# EAGLE design Caurin_CDH v.1.0 (EAGLE 9.2.0)
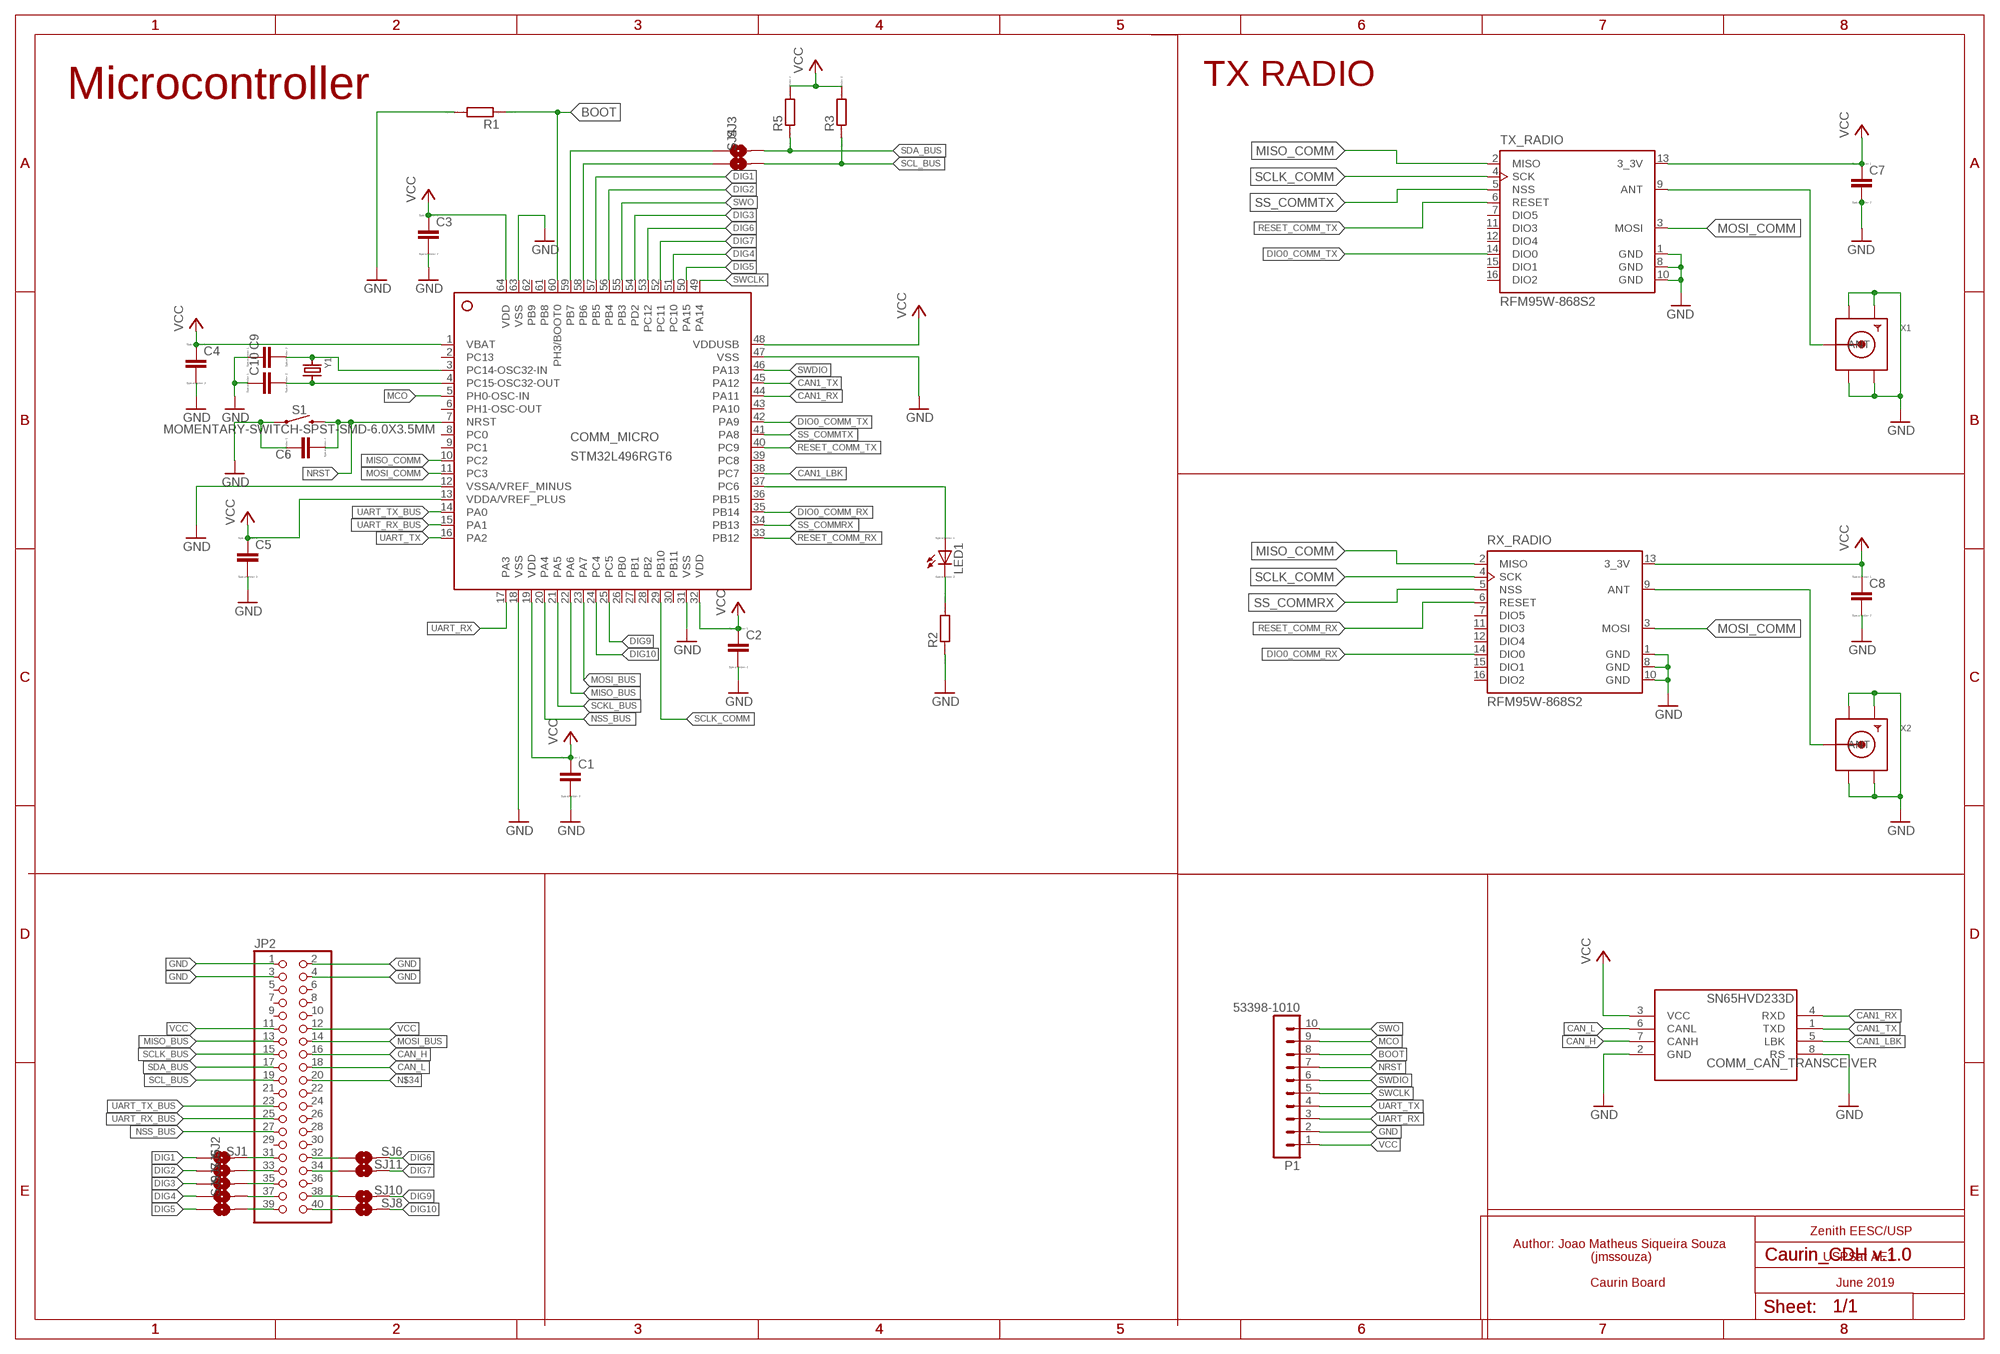
[diagram p0: schematic, sheet 1]

## Parts
C1  CC1206  [C1206]
C2  CC1206  [C1206]
C3  CC1206  [C1206]
C4  CC1206  [C1206]
C5  CC1206  [C1206]
C6  CC1206  [C1206]
C7  CC1206  [C1206]
C8  CC1206  [C1206]
C9  CC1206  [C1206]
C10  CC1206  [C1206]
COMM_CAN_TRANSCEIVER  SN65HVD233D  [SOIC8]
COMM_MICRO  STM32L496RGT6  [LQFP64_10X10]
JP2  PINHD-2X20  [2X20]
LED1  LED_E  [LED_1206]
P1  53398-1010  [53398-1010]
R1  RR1206  [R1206]
R2  RR1206  [R1206]
R3  RR1206  [R1206]
R5  RR1206  [R1206]
RX_RADIO  RFM95W-868S2  [XCVR_RFM95W-868S2]
S1  MOMENTARY-SWITCH-SPST-SMD-6.0X3.5MM  [TACTILE_SWITCH_SMD_6.0X3.5MM]
SJ1  SMD-JUMPER-2  [SMD-JUMPER-2]
SJ2  SMD-JUMPER-2  [SMD-JUMPER-2]
SJ3  SMD-JUMPER-2  [SMD-JUMPER-2]
SJ4  SMD-JUMPER-2  [SMD-JUMPER-2]
SJ5  SMD-JUMPER-2  [SMD-JUMPER-2]
SJ6  SMD-JUMPER-2  [SMD-JUMPER-2]
SJ7  SMD-JUMPER-2  [SMD-JUMPER-2]
SJ8  SMD-JUMPER-2  [SMD-JUMPER-2]
SJ9  SMD-JUMPER-2  [SMD-JUMPER-2]
SJ10  SMD-JUMPER-2  [SMD-JUMPER-2]
SJ11  SMD-JUMPER-2  [SMD-JUMPER-2]
TX_RADIO  RFM95W-868S2  [XCVR_RFM95W-868S2]
X1  SMACONNECTOR  [SMA90_DIP]
X2  SMACONNECTOR  [SMA90_DIP]
Y1  CRYSTAL8X3.8SMT  [CRYSTAL_8X3.8]

## Nets
BOOT: COMM_MICRO.60(PH3/BOOT0) P1.8 R1.1
CAN1_LBK: COMM_CAN_TRANSCEIVER.5(LBK) COMM_MICRO.38(PC7)
CAN1_RX: COMM_CAN_TRANSCEIVER.4(RXD) COMM_MICRO.44(PA11)
CAN1_TX: COMM_CAN_TRANSCEIVER.1(TXD) COMM_MICRO.45(PA12)
CAN_H: COMM_CAN_TRANSCEIVER.7(CANH) JP2.16
CAN_L: COMM_CAN_TRANSCEIVER.6(CANL) JP2.18
DIG1: COMM_MICRO.57(PB5) SJ1.1
DIG2: COMM_MICRO.56(PB4) SJ2.1
DIG3: COMM_MICRO.54(PD2) SJ5.1
DIG4: COMM_MICRO.51(PC10) SJ7.1
DIG5: COMM_MICRO.50(PA15) SJ9.1
DIG6: COMM_MICRO.53(PC12) SJ6.2
DIG7: COMM_MICRO.52(PC11) SJ11.2
DIG9: COMM_MICRO.25(PC5) SJ10.2
DIG10: COMM_MICRO.24(PC4) SJ8.2
DIO0_COMM_RX: COMM_MICRO.35(PB14) RX_RADIO.14(DIO0)
DIO0_COMM_TX: COMM_MICRO.42(PA9) TX_RADIO.14(DIO0)
GND: C1.2 C2.2 C3.2 C4.2 C5.2 C6.1 C7.2 C8.2 C9.1 C10.1 COMM_CAN_TRANSCEIVER.2(GND) COMM_CAN_TRANSCEIVER.8(RS) COMM_MICRO.12(VSSA/VREF_MINUS) COMM_MICRO.18(VSS) COMM_MICRO.31(VSS) COMM_MICRO.47(VSS) COMM_MICRO.63(VSS) JP2.1 JP2.2 JP2.3 JP2.4 P1.2 R1.2 R2.1 RX_RADIO.1(GND) RX_RADIO.8(GND) RX_RADIO.10(GND) S1.1 TX_RADIO.1(GND) TX_RADIO.8(GND) TX_RADIO.10(GND) X1.GND1 X1.GND2 X1.GND3 X1.GND4 X2.GND1 X2.GND2 X2.GND3 X2.GND4
MCO: COMM_MICRO.5(PH0-OSC-IN) P1.9
MISO_BUS: COMM_MICRO.22(PA6) JP2.13
MISO_COMM: COMM_MICRO.10(PC2) RX_RADIO.2(MISO) TX_RADIO.2(MISO)
MOSI_BUS: COMM_MICRO.23(PA7) JP2.14
MOSI_COMM: COMM_MICRO.11(PC3) RX_RADIO.3(MOSI) TX_RADIO.3(MOSI)
N$1: RX_RADIO.9(ANT) X2.ANTENNA(ANT)
N$2: COMM_MICRO.37(PC6) LED1.A
N$3: LED1.C R2.2
N$4: C9.2 COMM_MICRO.3(PC14-OSC32-IN) Y1.P$1
N$5: C10.2 COMM_MICRO.4(PC15-OSC32-OUT) Y1.P$4
N$6: TX_RADIO.9(ANT) X1.ANTENNA(ANT)
N$7: JP2.32 SJ6.1
N$8: COMM_MICRO.59(PB7) SJ3.1
N$9: COMM_MICRO.58(PB6) SJ4.1
N$10: JP2.34 SJ11.1
N$11: JP2.38 SJ10.1
N$12: JP2.40 SJ8.1
N$14: JP2.37 SJ7.2
N$15: JP2.39 SJ9.2
N$16: JP2.35 SJ5.2
N$17: JP2.33 SJ2.2
N$18: JP2.31 SJ1.2
N$34: JP2.20
NRST: C6.2 COMM_MICRO.7(NRST) P1.7 S1.2
NSS_BUS: COMM_MICRO.20(PA4) JP2.27
RESET_COMM_RX: COMM_MICRO.33(PB12) RX_RADIO.6(RESET)
RESET_COMM_TX: COMM_MICRO.40(PC9) TX_RADIO.6(RESET)
SCKL_BUS: COMM_MICRO.21(PA5)
SCL_BUS: JP2.19 R3.1 SJ4.2
SCLK_BUS: JP2.15
SCLK_COMM: COMM_MICRO.29(PB10) RX_RADIO.4(SCK) TX_RADIO.4(SCK)
SDA_BUS: JP2.17 R5.1 SJ3.2
SS_COMMRX: COMM_MICRO.34(PB13) RX_RADIO.5(NSS)
SS_COMMTX: COMM_MICRO.41(PA8) TX_RADIO.5(NSS)
SWCLK: COMM_MICRO.49(PA14) P1.5
SWDIO: COMM_MICRO.46(PA13) P1.6
SWO: COMM_MICRO.55(PB3) P1.10
UART_RX: COMM_MICRO.17(PA3) P1.3
UART_RX_BUS: COMM_MICRO.15(PA1) JP2.25
UART_TX: COMM_MICRO.16(PA2) P1.4
UART_TX_BUS: COMM_MICRO.14(PA0) JP2.23
VCC: C1.1 C2.1 C3.1 C4.1 C5.1 C7.1 C8.1 COMM_CAN_TRANSCEIVER.3(VCC) COMM_MICRO.1(VBAT) COMM_MICRO.13(VDDA/VREF_PLUS) COMM_MICRO.19(VDD) COMM_MICRO.32(VDD) COMM_MICRO.48(VDDUSB) COMM_MICRO.64(VDD) JP2.11 JP2.12 P1.1 R3.2 R5.2 RX_RADIO.13(3_3V) TX_RADIO.13(3_3V)
Unconnected: COMM_MICRO.2(PC13) COMM_MICRO.6(PH1-OSC-OUT) COMM_MICRO.8(PC0) COMM_MICRO.9(PC1) COMM_MICRO.26(PB0) COMM_MICRO.27(PB1) COMM_MICRO.28(PB2) COMM_MICRO.30(PB11) COMM_MICRO.36(PB15) COMM_MICRO.39(PC8) COMM_MICRO.43(PA10) COMM_MICRO.61(PB8) COMM_MICRO.62(PB9) JP2.5 JP2.6 JP2.7 JP2.8 JP2.9 JP2.10 JP2.21 JP2.22 JP2.24 JP2.26 JP2.28 JP2.29 JP2.30 JP2.36 RX_RADIO.7(DIO5) RX_RADIO.11(DIO3) RX_RADIO.12(DIO4) RX_RADIO.15(DIO1) RX_RADIO.16(DIO2) TX_RADIO.7(DIO5) TX_RADIO.11(DIO3) TX_RADIO.12(DIO4) TX_RADIO.15(DIO1) TX_RADIO.16(DIO2)

## Notes on the sheet
- TX RADIO
- Microcontroller
- Zenith EESC/USP
- Author: Joao Matheus Siqueira Souza
- (jmssouza) | USPSat AE1
- Caurin Board | June 2019

## Library data of the parts
C1-C10 = eagle-ltspice:C: CAPACITOR, European symbol; SPICEMODEL: NONE; SPICEPREFIX: C
COMM_CAN_TRANSCEIVER = SN65HVD233D:SN65HVD233D; AVAILABILITY: Unavailable; DESCRIPTION: 3.3V CAN Transceiver with Standby Mode, Loop-back 8-SOIC -40 to 125; MF: Texas Instruments; MP: SN65HVD233D; PACKAGE: SOIC-8 Texas Instruments; PRICE: None
COMM_MICRO = STM32L4xxx:STM32L496R*: STM32L496RX LQFP64 Cortex M4, 80MHz, 512kB-1024kB Flash, 320kB SRAM Datasheet STM32L496XX <http://www.st.com/content/ccc/resource/technical/document/datasheet/group3/3f/73/19/d1/d4/9e/48/34/DM00284211/files/DM00284211.pdf/jcr:content/translations/en.DM00284211.pdf>; FARNELL: 2725138; FLASH: 1024kB; SRAM: 320kB
JP2 = pinhead:PINHD-2X20: PIN HEADER
LED1 = eagle-ltspice:LED_E: LED Source: http://www.osram.convergy.de Source: www.luxeon.com Source: www.kingbright.com; SPICEMODEL: NONE; SPICEPREFIX: D; SPICETYPE: diode
P1 = con-molex-picoblade:53398-1010: HEADER
R1-R3 R5 = eagle-ltspice:R: RESISTOR, European symbol; SPICEMODEL: NONE; SPICEPREFIX: R
RX_RADIO TX_RADIO = RFM95W-868S2:RFM95W-868S2: Mod Txrx Lora +20dbm 868mhz Smd; AVAILABILITY: Unavailable; MF: RF; MP: RFM95W-868S2; PACKAGE: SMD-16 Hope Microelectronics; PRICE: None
S1 = SparkFun-Switches:MOMENTARY-SWITCH-SPST: Momentary Switch (Pushbutton) - SPST Normally-open (NO) SPST momentary switches (buttons, pushbuttons). Variants PTH-12MM - 12mm square, through-hole Momentary Pushbutton Switch - 12mm Square <https://www.sparkfun.com/products/9190> (COM-09190) PTH-6.0MM, PTH-6.0MM-KIT - 6.0mm square, through-hole Mini Pushbutton Switch <https://www.sparkfun.com/products/97> (COM-00097) KIT package intended for soldering kit's - only one side of pads' copper is exposed. PTH-RIGHT-ANGLE-KIT - Right-angle, through-hole Right Angle Tactile Button <https://www.sparkfun.com/products/10791> - Used on SparkFun BigTime Watch Kit <https://www.sparkfun.com/products/11734> SMD-12MM - 12mm square, surface-mount Tactile Button - SMD (12mm) <https://www.sparkfun.com/products/12993> (COM-12993) Used on SparkFun PicoBoard <https://www.sparkfun.com/products/11888> SMD-4.5MM - 4.5mm Square Trackball Switch Used on SparkFun Blackberry Trackballer Breakout <https://www.sparkfun.com/products/13169> SMD-4.6MMX2.8MM - 4.60mm x 2.80mm, surface mount Used on SparkFun SAMD21 Mini Breakout <https://www.sparkfun.com/products/13664> SMD-5.2MM, SMD-5.2-REDUNDANT - 5.2mm square, surface-mount Mini Pushbutton Switch - SMD <https://www.sparkfun.com/products/8720> (COM-08720) Used on Arduino Pro Mini <https://www.sparkfun.com/products/11114> REDUNDANT package connects both switch circuits together SMD-6.0X3.5MM - 6.0 x 3.5mm, surface mount Momentary Reset Switch SMD <https://www.sparkfun.com/products/8229> (COM-08229) SMD-6.2MM-TALL - 6.2mm square, surface mount Tactile Button - SMD (6mm) <https://www.sparkfun.com/products/12992> Used on SparkFun Digital Sandbox <https://www.sparkfun.com/products/12651> SMD-RIGHT-ANGLE - Right-angle, surface mount Used on SparkFun Block for Intel® Edison - Arduino <https://www.sparkfun.com/products/13036>; PROD_ID: SWCH-00815; SF_SKU: COM-08229
SJ1-SJ11 = FaBo-PIN:SMD-JUMPER-2
X1 X2 = adafruit:SMACONNECTOR: SMA Connector 90° DIP SMA Connector, 50 Ohm (4UConnector: 07259)
Y1 = microbuilder:CRYSTAL: Crystals HC49UP - Surface Mount Crystal 4.0MHz 18pF +/-30ppm Surface Mount Crystal [Digikey: 535-9857-1-ND] 12.0 MHz Surface Mount Crystal [Digikey: 535-9869-6-ND] 25.0 MHz Surface Mount Crystal [Digikey: 535-9078-1-ND] 2.5 x 2.0mm - MEMs SMT Crystal 16.0 MHz 10pF 20ppm 2.5 x 2.0mm Crystal [Digikey -40-85°C: 535-10923-1-ND] 3.2 x 2.5mm - MEMs SMT Crystal 12.0 MHz 8pF 15ppm 3.2 x 2.5mm Crystal [Digikey: -10-70°C: 644-1047-1-ND -40-125°C: 644-1128-1-ND] 16.0 MHz 8pF 15ppm 3.2 x 2.5mm Crystal [Digikey: -10-70°C: 644-1049-1-ND -40-125°C: 644-1129-2-ND] 16.0 MHz 10pF 10ppm 3.2 x 2.5mm Crystal [Digikey: 644-1100-1-ND] 27.12 MHz 18pF 30ppm 3.2 x 2.5mm Crystal [Digikey: 887-1424-1-ND] 27.12MHz 10pF 10ppm 3.2 x 2.5mm Crystal [Digikey: 887-1329-1-ND] 4.9 x 1.8mm - MEMs SMT Crystal 32.768 KHz 12.5pF 20ppm 4.9 x 1.8mm Crystal [Digikey: SE2415CT-ND] 8.0 x 3.8mm - Surface Mount Crystal 32.768kHz 12.5pF 20ppm -40°C-85°C [Digikey: 535-9166-2-ND] Cylinder 32.768KHz Cylinder Crystal (2x6mm body) [Ex. Digikey: 300-8341-2-ND]

## Board
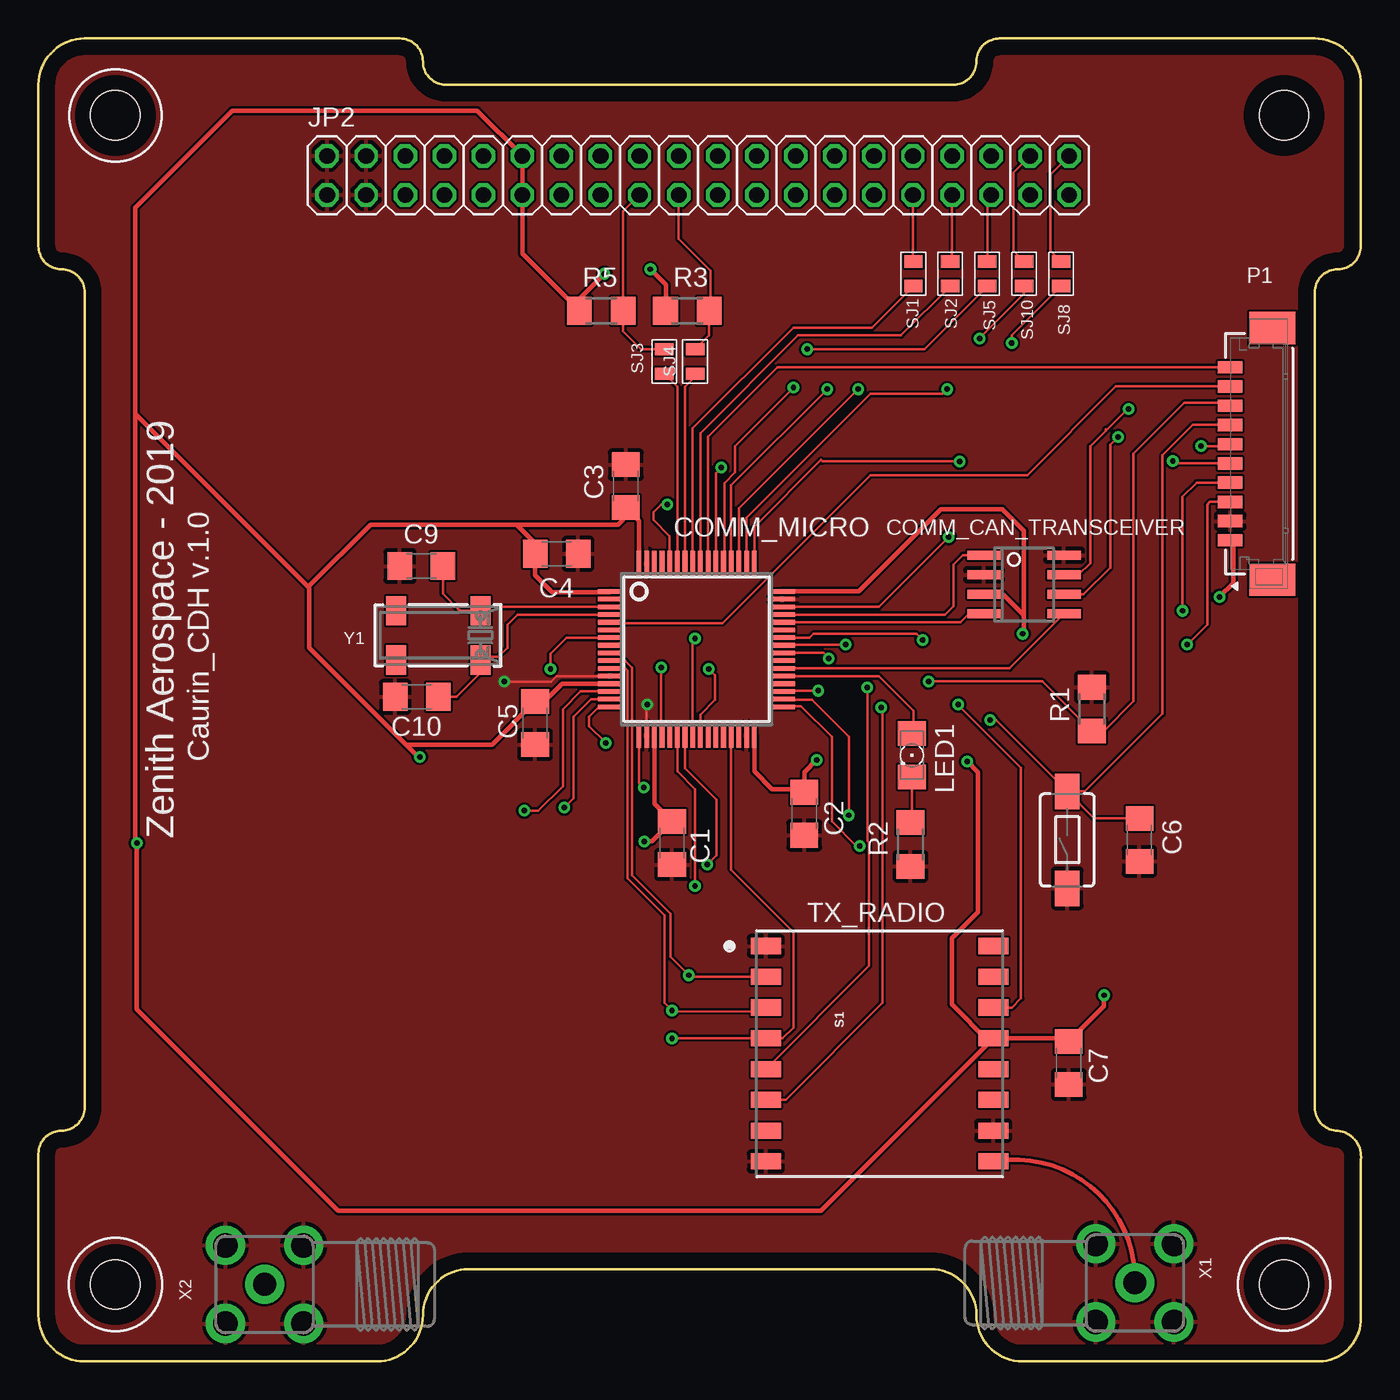
[diagram p1: board, top side]
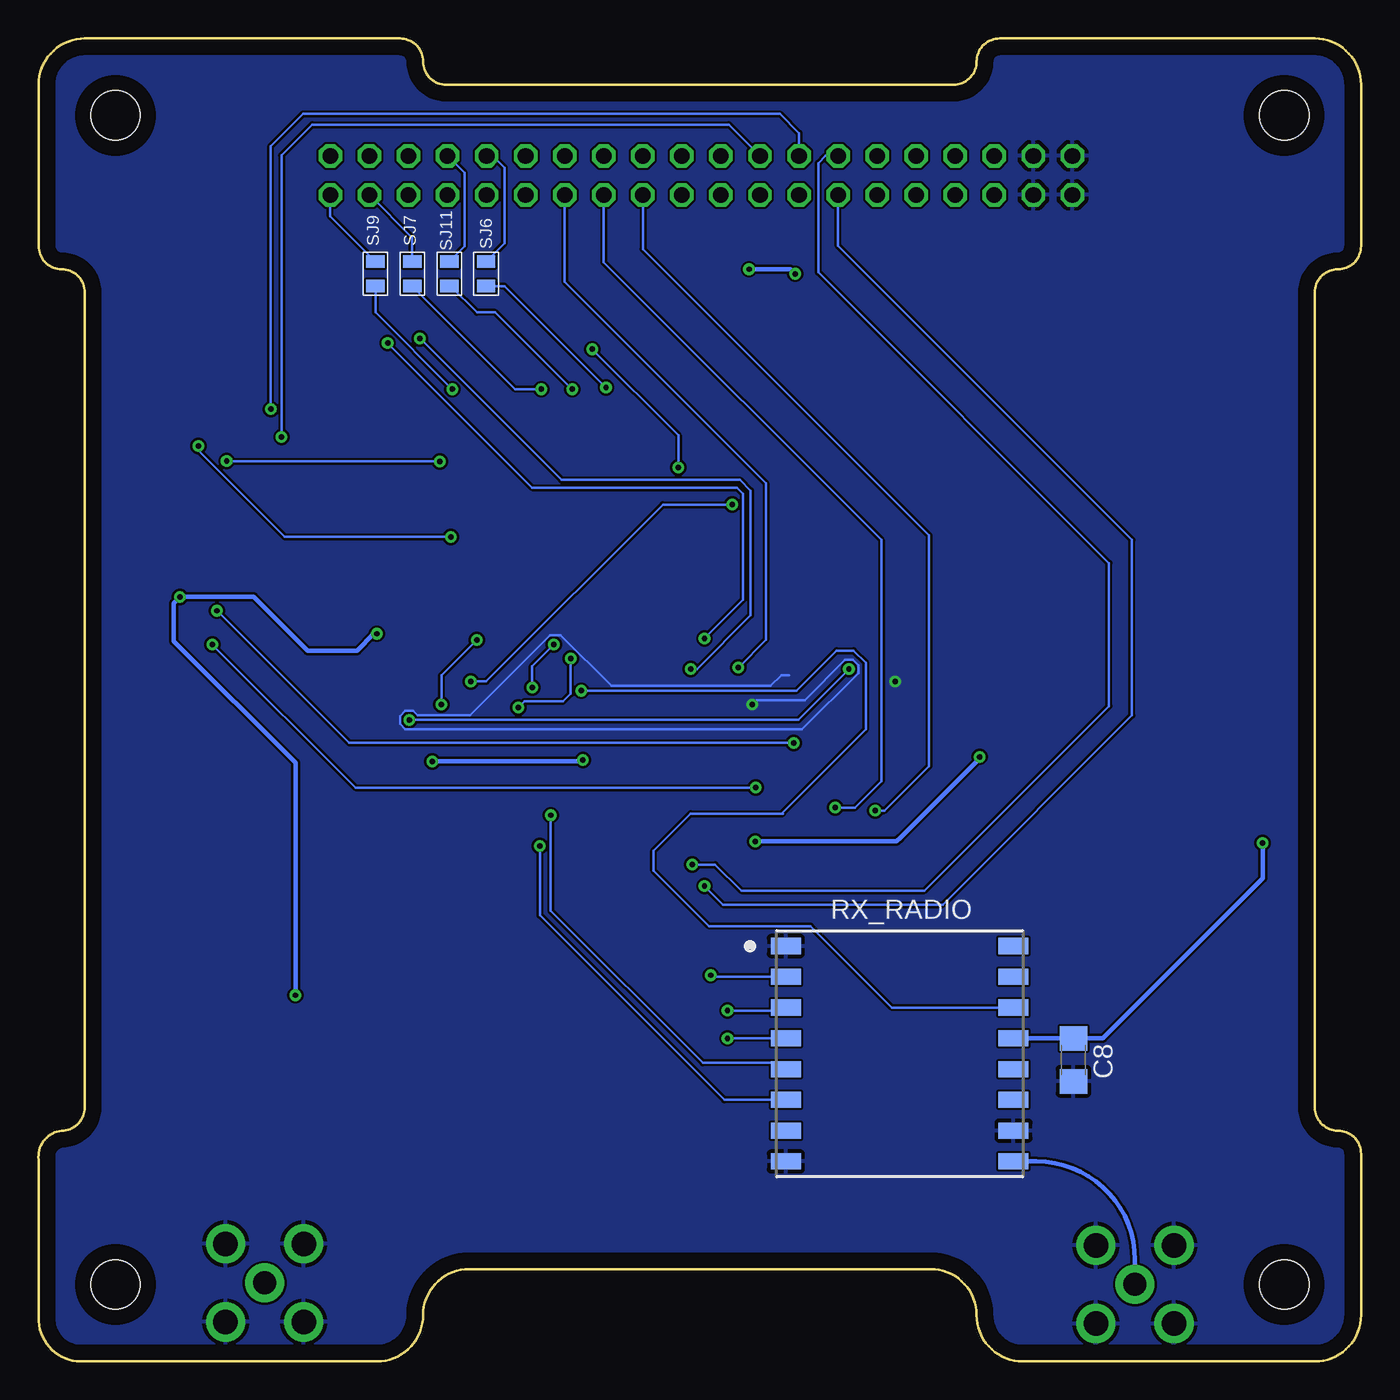
[diagram p2: board, bottom side, seen from below]

Size 86.01 x 86.01 mm. Coordinates in mm from the lower left corner, seen from the top.
Outline: 0,83.01 0,72.51 arc90 1.5,71.01 arc-90 3,69.51 3,16.51 arc-90 1.5,15.01 arc90 0,13.51 0,3.01 arc90 3,0.01 22,0.01 arc90 25,3.01 arc-90 28,6.01 58,6.01 arc-90 61,3.01 arc90 64,0.01 83,0.01 arc90 86,2.61 86,13.11 arc90 84.5,15.01 arc-90 83,16.51 83,69.51 arc-90 84.5,71.01 arc90 86,72.51 86,83.01 arc90 83,86.01 62.5,86.01 arc90 61,84.51 arc-90 59.5,83.01 26.5,83.01 arc-90 25,84.51 arc90 23.5,86.01 3,86.01 arc90 0,83.01
Copper layers (1*16): Top 0.035mm / dielectric 1.5mm / Bottom 0.035mm
Design rules "default": minimum track width 6mil, minimum drill 0.35mm, track to track 6mil, track to pad 6mil, pad to pad 6mil, via to via 6mil, smd to smd 6mil, copper to edge 40mil, drill to drill 6mil, minimum pad ring 10mil, minimum via ring 8mil, stop-mask expansion 4mil, vias tented up to drill 0mil, thermal gap 10mil
Holes 3.2 mm at 5,5.01 81,5.01 81,81.01 5,81.01

### Footprints (pad centres in the part's own frame; a part is rotated, then mirrored left to right if it is on the bottom)
C1206 = smd 1.6 x 1.8: 1 -1.4,0; 2 1.4,0
SOIC8 = smd 0.6 x 2.2: 1 -1.905,-2.6; 2 -0.635,-2.6; 3 0.635,-2.6; 4 1.905,-2.6; 5 1.905,2.6; 6 0.635,2.6; 7 -0.635,2.6; 8 -1.905,2.6
LQFP64_10X10 = smd 0.3 x 1.6: 1 -3.75,-5.6; 2 -3.25,-5.6; 3 -2.75,-5.6; 4 -2.25,-5.6; 5 -1.75,-5.6; 6 -1.25,-5.6; 7 -0.75,-5.6; 8 -0.25,-5.6; 9 0.25,-5.6; 10 0.75,-5.6; 11 1.25,-5.6; 12 1.75,-5.6; 13 2.25,-5.6; 14 2.75,-5.6; 15 3.25,-5.6; 16 3.75,-5.6; 33 3.75,5.6; 34 3.25,5.6; 35 2.75,5.6; 36 2.25,5.6; 37 1.75,5.6; 38 1.25,5.6; 39 0.75,5.6; 40 0.25,5.6; 41 -0.25,5.6; 42 -0.75,5.6; 43 -1.25,5.6; 44 -1.75,5.6; 45 -2.25,5.6; 46 -2.75,5.6; 47 -3.25,5.6; 48 -3.75,5.6 | smd 1.6 x 0.3: 17 5.6,-3.75; 18 5.6,-3.25; 19 5.6,-2.75; 20 5.6,-2.25; 21 5.6,-1.75; 22 5.6,-1.25; 23 5.6,-0.75; 24 5.6,-0.25; 25 5.6,0.25; 26 5.6,0.75; 27 5.6,1.25; 28 5.6,1.75; 29 5.6,2.25; 30 5.6,2.75; 31 5.6,3.25; 32 5.6,3.75; 49 -5.6,3.75; 50 -5.6,3.25; 51 -5.6,2.75; 52 -5.6,2.25; 53 -5.6,1.75; 54 -5.6,1.25; 55 -5.6,0.75; 56 -5.6,0.25; 57 -5.6,-0.25; 58 -5.6,-0.75; 59 -5.6,-1.25; 60 -5.6,-1.75; 61 -5.6,-2.25; 62 -5.6,-2.75; 63 -5.6,-3.25; 64 -5.6,-3.75
2X20 = drill 1.016 octagon: 1 -24.13,-1.27; 2 -24.13,1.27; 3 -21.59,-1.27; 4 -21.59,1.27; 5 -19.05,-1.27; 6 -19.05,1.27; 7 -16.51,-1.27; 8 -16.51,1.27; 9 -13.97,-1.27; 10 -13.97,1.27; 11 -11.43,-1.27; 12 -11.43,1.27; 13 -8.89,-1.27; 14 -8.89,1.27; 15 -6.35,-1.27; 16 -6.35,1.27; 17 -3.81,-1.27; 18 -3.81,1.27; 19 -1.27,-1.27; 20 -1.27,1.27; 21 1.27,-1.27; 22 1.27,1.27; 23 3.81,-1.27; 24 3.81,1.27; 25 6.35,-1.27; 26 6.35,1.27; 27 8.89,-1.27; 28 8.89,1.27; 29 11.43,-1.27; 30 11.43,1.27; 31 13.97,-1.27; 32 13.97,1.27; 33 16.51,-1.27; 34 16.51,1.27; 35 19.05,-1.27; 36 19.05,1.27; 37 21.59,-1.27; 38 21.59,1.27; 39 24.13,-1.27; 40 24.13,1.27
LED_1206 = smd 1.6 x 1.803: A -1.422,0; C 1.422,0
53398-1010 = smd 0.8 x 1.6: 1 5.625,0; 2 4.375,0; 3 3.125,0; 4 1.875,0; 5 0.625,0; 6 -0.625,0; 7 -1.875,0; 8 -3.125,0; 9 -4.375,0; 10 -5.625,0 | smd 2.1 x 3: M1 8.185,2.75; M2 -8.185,2.75
R1206 = smd 1.6 x 1.803: 1 -1.422,0; 2 1.422,0
XCVR_RFM95W-868S2 = smd 1.95 x 1.05: 1 -7.4,7; 2 -7.4,5; 3 -7.4,3; 4 -7.4,1; 5 -7.4,-1; 6 -7.4,-3; 7 -7.4,-5; 8 -7.4,-7; 9 7.4,-7; 10 7.4,-5; 11 7.4,-3; 12 7.4,-1; 13 7.4,1; 14 7.4,3; 15 7.4,5; 16 7.4,7
TACTILE_SWITCH_SMD_6.0X3.5MM = smd 2.3 x 1.6: 1 -3.15,0; 2 3.15,0
SMD-JUMPER-2 = smd 0.8 x 1.2: 1 -0.8,0; 2 0.8,0
SMA90_DIP = drill 1.5 pad 2.54: ANTENNA 0,0 | drill 1.6 pad 2.54: GND1 -2.54,2.54; GND2 2.54,2.54; GND3 -2.54,-2.54; GND4 2.54,-2.54
CRYSTAL_8X3.8 = smd 1.3 x 1.9: P$1 -2.75,-1.6; P$2 2.75,-1.6; P$3 2.75,1.6; P$4 -2.75,1.6

### Placement (x,y rotation side)
C1  41.2,33.71 270 top
C2  49.8,35.61 270 top
C3  38.2,56.91 90 top
C4  33.7,52.51 0 top
C5  32.3,41.51 270 top
C6  71.6,33.91 90 top
C7  67,19.41 270 top
C8  18.7,19.61 270 bottom
C9  24.9,51.71 0 top
C10  24.6,43.21 0 top
COMM_CAN_TRANSCEIVER  64.1,50.51 270 top
COMM_MICRO  42.8,46.31 270 top
JP2  42.9,77.11 0 top
LED1  56.8,39.41 270 top
P1  77.5,59.01 270 top
R1  68.5,42.41 90 top
R2  56.7,33.61 90 top
R3  42.2,68.31 180 top
R5  36.6,68.31 180 top
RX_RADIO  30,20.01 0 bottom
S1  66.9,33.91 90 top
SJ1  56.9,70.71 90 top
SJ2  59.3,70.71 90 top
SJ3  40.7,65.01 90 top
SJ4  42.7,65.01 90 top
SJ5  61.7,70.71 90 top
SJ6  56.9,70.71 270 bottom
SJ7  61.7,70.71 90 bottom
SJ8  66.5,70.71 270 top
SJ9  64.1,70.71 90 bottom
SJ10  64.1,70.71 270 top
SJ11  59.3,70.71 270 bottom
TX_RADIO  54.7,20.01 0 top
X1  71.3,5.11 90 top
X2  14.7,5.01 270 top
Y1  26,47.21 180 top

### Tracks (layer width: path | path; a pad name or v marks a point on that pad's centre or on a via)
BOOT  (via drill 0.35)
  Top 0.152: P1.8 77.5,62.31 74.5,62.31 71.2,59 71.2,42.91 69.28,40.98 R1.1 65.28,44.21 v57.9,44.21 | v40.9,55.71 40.5,55.71 40,55.21 40,54.71 41.05,53.66 COMM_MICRO.60
  Bottom 0.152: v57.9,44.21 56.9,44.21 45.4,55.71 v40.9,55.71
CAN1_LBK
  Top 0.152: COMM_CAN_TRANSCEIVER.5 63.16,45.06 COMM_MICRO.38
CAN1_RX
  Top 0.152: COMM_CAN_TRANSCEIVER.4 60.49,48.6 59.95,48.06 COMM_MICRO.44
CAN1_TX
  Top 0.152: COMM_CAN_TRANSCEIVER.1 60.1,52.41 59.5,51.81 59.5,49.11 58.95,48.56 COMM_MICRO.45
CAN_H  (via drill 0.35)
  Top 0.152: COMM_CAN_TRANSCEIVER.7 67.64,51.14 68.4,51.91 68.4,59.51 69.4,60.51 | 69.4,60.51 69.4,60.61 | 69.4,60.51 70.8,61.91 v70.9,61.91
  Bottom 0.152: v70.9,61.91 70.9,79.01 68.8,81.11 37.8,81.11 36.55,79.86 JP2.16
CAN_L  (via drill 0.35)
  Top 0.152: COMM_CAN_TRANSCEIVER.6 67.97,49.87 69.7,51.61 69.7,59.61 v70.2,60.11
  Bottom 0.152: v70.2,60.11 70.2,78.41 68.2,80.41 41.12,80.41 JP2.18
DIG1
  Top 0.152: SJ1.1 54.2,67.21 49.1,67.21 42.55,60.66 COMM_MICRO.57
DIG2
  Top 0.152: SJ2.1 56.1,66.71 49.4,66.71 43.05,60.36 COMM_MICRO.56
DIG3  (via drill 0.35)
  Top 0.152: SJ5.1 57.6,65.81 v50,65.81 | v44.4,58.11 44.05,57.76 COMM_MICRO.54
  Bottom 0.152: v50,65.81 44.4,60.21 v44.4,58.11
DIG4  (via drill 0.35)
  Top 0.152: COMM_MICRO.51 45.55,55.46 v53.3,63.21
  Bottom 0.152: v53.3,63.21 55,63.21 SJ7.1
DIG5  (via drill 0.35)
  Top 0.152: COMM_MICRO.50 46.05,54.86 54.1,62.91 58.8,62.91 v59.1,63.21
  Bottom 0.152: v59.1,63.21 64.1,68.21 SJ9.1
DIG6  (via drill 0.35)
  Top 0.152: v49.1,63.31 45.3,59.51 45.3,57.81 44.6,57.11 44.6,52.51 44.5,52.41 44.55,52.36 COMM_MICRO.53
  Bottom 0.152: v49.1,63.31 55.7,69.91 SJ6.2
DIG7  (via drill 0.35)
  Top 0.152: v51.3,63.21 45.05,56.96 COMM_MICRO.52
  Bottom 0.152: v51.3,63.21 56.3,68.21 57.5,68.21 59.2,69.91 SJ11.2
DIG9  (via drill 0.35)
  Top 0.152: SJ10.2 64.1,69.41 v61.2,66.51 | v43.6,45.01 44,44.61 44,43.01 43.05,42.06 COMM_MICRO.25
  Bottom 0.152: v61.2,66.51 52,57.31 40.4,57.31 39.7,56.61 39.7,48.51 43.2,45.01 v43.6,45.01
DIG10  (via drill 0.35)
  Top 0.152: SJ8.2 63.3,66.71 v63.3,66.21 | v42.7,47.01 42.55,46.86 COMM_MICRO.24
  Bottom 0.152: v63.3,66.21 53.9,56.81 40.6,56.81 40.2,56.41 40.2,49.51 v42.7,47.01
DIO0_COMM_RX  (via drill 0.35)
  Top 0.152: v50.7,43.61 48.45,43.61 COMM_MICRO.35
  Bottom 0.152: RX_RADIO.14 30.5,23.01 35.8,28.31 42.4,28.31 46,31.91 46,33.21 43.6,35.61 37.7,35.61 | 37.7,35.61 37.6,35.61 | 37.7,35.61 32.2,41.11 32.2,45.41 33,46.21 34.1,46.21 36.7,43.61 v50.7,43.61
DIO0_COMM_TX  (via drill 0.35)
  Top 0.152: TX_RADIO.14 63.3,23.01 63.9,23.61 63.9,38.61 v59.8,42.71 | v57.5,46.91 57.1,47.31 50.4,47.31 50.15,47.06 COMM_MICRO.42
  Bottom 0.152: v59.8,42.71 59.8,44.61 v57.5,46.91
GND  (via drill 0.35)
  Top 0.152: COMM_MICRO.18 39.55,42.66 v39.6,42.71 | COMM_MICRO.12 33.71,44.56 33.35,44.2 v30.31,44.2 v30.3,44.21
  Bottom 0.152: 37.2,44.61 37.7,44.61 38.4,43.91 48.75,43.91 52.05,47.21 52.75,47.21 57.95,42.01 61.35,42.01 61.65,42.31 62.15,42.31 62.51,41.96 62.51,41.46 62.15,41.1 36.35,41.1 32.69,44.76 32.69,45.26 33.05,45.61 33.55,45.61 36.16,43 39.31,43 v39.6,42.71
  pour Top: 64,0.01 83,0.01 arc90 86,3.01 86,13.51 arc90 84.5,15.01 arc-90 83,16.51 83,69.51 arc-90 84.5,71.01 arc90 86,72.51 86,83.01 arc90 83,86.01 62.5,86.01 arc90 61,84.51 arc-90 59.5,83.01 26.5,83.01 arc-90 25,84.51 arc90 23.5,86.01 3,86.01 arc90 0,83.01 0,72.51 arc90 1.5,71.01 arc-90 3,69.51 3,16.51 arc-90 1.5,15.01 arc90 0,13.51 0,3.01 arc90 3,0.01 22,0.01 arc90 25,3.01 arc-90 28,6.01 58,6.01 arc-90 61,3.01 arc90
  pour Bottom: 64,0.01 83,0.01 arc90 86,3.01 86,13.51 arc90 84.5,15.01 arc-90 83,16.51 83,69.51 arc-90 84.5,71.01 arc90 86,72.51 86,83.01 arc90 83,86.01 62.5,86.01 arc90 61,84.51 arc-90 59.5,83.01 26.5,83.01 arc-90 25,84.51 arc90 23.5,86.01 3,86.01 arc90 0,83.01 0,72.51 arc90 1.5,71.01 arc-90 3,69.51 3,16.51 arc-90 1.5,15.01 arc90 0,13.51 0,3.01 arc90 3,0.01 22,0.01 arc90 25,3.01 arc-90 28,6.01 58,6.01 arc-90 61,3.01 arc90
MCO
  Top 0.152: P1.9 70.08,63.38 64.3,57.61 54.1,57.61 44.5,48.01 37.25,48.01 COMM_MICRO.5
MISO_BUS  (via drill 0.35)
  Top 0.152: COMM_MICRO.22 41.55,38.36 42.7,37.21 v42.7,30.9 | 42.7,30.81 v42.7,30.9 | v42.7,30.9 v42.69,30.91
  Bottom 0.152: v42.69,30.91 41.49,29.71 27.2,29.71 14.9,42.01 14.9,53.41 34.01,72.52 JP2.13
MISO_COMM  (via drill 0.35)
  Top 0.152: TX_RADIO.2 42.4,25.01 v42.3,25.11 41.1,26.31 41.1,29.11 38.6,31.61 38.6,45.11 38.15,45.56 COMM_MICRO.10
  Bottom 0.152: RX_RADIO.2 42.2,25.01 v42.3,25.11
MOSI_BUS  (via drill 0.35)
  Top 0.152: COMM_MICRO.23 42.05,38.56 44.1,36.51 44.1,32.91 v43.5,32.31
  Bottom 0.152: v43.5,32.31 42,32.31 40.3,30.61 28.4,30.61 16.4,42.61 16.4,51.91 35.3,70.81 35.3,77.91 34.83,78.38 JP2.14
MOSI_COMM  (via drill 0.35)
  Top 0.152: TX_RADIO.3 47.03,22.74 41.23,22.77 v41.2,22.81 40.7,23.31 40.7,29.01 38.3,31.41 38.3,44.91 38.2,45 38.2,45.01 38.15,45.06 COMM_MICRO.11
  Bottom 0.152: v41.2,22.81 37.6,22.81 RX_RADIO.3
N$1
  Bottom 0.305: RX_RADIO.9 21.1,13.01 arc90 14.7,6.61 X2.ANTENNA
N$2
  Top 0.152: COMM_MICRO.37 54.65,44.56 56.9,42.31 56.9,40.51 56.7,40.31 | 56.7,40.31 56.6,40.31 | 56.7,40.31 57,40.31 57,40.63 LED1.A
N$3
  Top 0.152: LED1.C 56.8,35.13 R2.2
N$4
  Top 0.152: 29,49.06 COMM_MICRO.3 | Y1.P$1 27.4,48.81 27.35,48.86 27.3,48.91 26.3,49.91 C9.2
  Top 0.305: 29,49.06 Y1.P$1 28.75,49.26
N$5
  Top 0.152: COMM_MICRO.4 31.15,48.56 30.5,47.91 30.5,46.41 29.9,45.81 28.95,45.81 Y1.P$4 28.75,44.76 27.2,43.21 C10.2
  Top 0.305: 26.35,43.21 C10.2
N$6
  Top 0.305: TX_RADIO.9 arc-90 62.2,13.11 63.79,13.11 arc-90 X1.ANTENNA
N$7
  Bottom 0.152: SJ6.1 55.7,72.71 55.7,77.61 56.47,78.38 JP2.32
N$8
  Top 0.152: SJ3.1 41.55,63.36 COMM_MICRO.59
N$9
  Top 0.152: SJ4.1 42.7,64.01 42.05,63.36 COMM_MICRO.58
N$10
  Bottom 0.152: SJ11.1 58.3,72.51 58.3,77.27 JP2.34
N$11
  Top 0.152: JP2.38 63.4,77.29 63.4,72.21 SJ10.1
N$12
  Top 0.152: JP2.40 65.8,77.15 65.8,72.21 SJ8.1
N$14
  Bottom 0.152: SJ7.2 61.7,73.05 JP2.37
N$15
  Bottom 0.152: SJ9.2 67.03,74.44 JP2.39
N$16
  Top 0.152: JP2.35 61.7,75.59 SJ5.2
N$17
  Top 0.152: JP2.33 59.41,71.51 SJ2.2
N$18
  Top 0.152: JP2.31 56.87,71.54 SJ1.2
NRST  (via drill 0.35)
  Top 0.152: P1.7 75.08,60.88 73.1,58.91 73.1,42.11 68.05,37.06 S1.2 | S1.2 68.65,35.31 C6.2 | S1.2 62.25,41.71 v61.9,41.71 | v33.3,45.01 33.3,46.01 34.35,47.06 COMM_MICRO.7
  Bottom 0.152: v61.9,41.71 36.6,41.71 v33.3,45.01
NSS_BUS  (via drill 0.35)
  Top 0.152: v40.5,45.11 40.5,40.76 COMM_MICRO.20
  Bottom 0.152: JP2.27 51.79,70.2 38.7,57.11 38.7,46.91 v40.5,45.11
RESET_COMM_RX  (via drill 0.35)
  Top 0.152: v53.4,33.51 53.2,33.51 51.6,35.11 51.6,40.61 49.6,42.61 48.45,42.61 COMM_MICRO.33
  Bottom 0.152: RX_RADIO.6 41.4,17.01 53.4,29.01 v53.4,33.51
RESET_COMM_TX  (via drill 0.35)
  Top 0.152: TX_RADIO.6 48.6,17.01 54.9,23.31 54.9,42.41 v54.8,42.51 | v51.4,45.71 51.05,46.06 COMM_MICRO.40
  Bottom 0.152: v54.8,42.51 54.4,42.91 51.9,42.91 51.4,43.41 v51.4,45.71
SCL_BUS
  Top 0.152: R3.1 43.62,68.11 | 43.62,68.11 43.62,66.73 SJ4.2 | JP2.19 41.63,72.98 43.7,70.91 43.7,68.18 43.62,68.11
SCLK_COMM  (via drill 0.35)
  Top 0.152: v41.2,21.01 41.21,21.02 41.6,21.01 TX_RADIO.4 48.4,21.01 49.1,21.71 49.1,27.91 45.05,31.96 COMM_MICRO.29
  Bottom 0.152: RX_RADIO.4 v41.2,21.01
SDA_BUS
  Top 0.152: SJ3.2 39.2,65.81 38.02,66.98 R5.1 38.02,74.77 JP2.17
SS_COMMRX  (via drill 0.35)
  Top 0.152: v52.7,35.51 52.7,40.61 50.3,43.01 48.45,43.01 COMM_MICRO.34
  Bottom 0.152: RX_RADIO.5 37.8,19.41 42.8,19.41 52.7,29.31 v52.7,35.51
SS_COMMTX  (via drill 0.35)
  Top 0.152: v53.9,43.81 53.9,33.86 54.01,33.76 54.01,25.71 TX_RADIO.5 | v52.5,46.61 49,46.61 48.95,46.56 COMM_MICRO.41
  Bottom 0.152: v53.9,43.81 53.9,45.21 v52.5,46.61
SWCLK  (via drill 0.35)
  Top 0.152: P1.5 73.92,58.38 v73.77,58.54 | v59.9,58.51 51,58.51 50.9,58.61 46.55,54.26 COMM_MICRO.49
  Bottom 0.152: v73.77,58.54 59.93,58.54 v59.9,58.51
SWDIO  (via drill 0.35)
  Top 0.152: P1.6 77.38,59.51 v75.6,59.51 | v59.2,53.61 54.65,49.06 COMM_MICRO.46
  Bottom 0.152: v75.6,59.51 75.6,59.21 70,53.61 v59.2,53.61
SWO
  Top 0.152: P1.10 48.06,64.63 43.55,60.12 COMM_MICRO.55
UART_RX  (via drill 0.35)
  Top 0.152: P1.3 76.17,55.88 76,55.71 76,47.91 v74.7,46.61 | v39.37,37.31 39.05,37.62 COMM_MICRO.17
  Bottom 0.152: v74.7,46.61 65.4,37.31 v39.37,37.31
UART_RX_BUS  (via drill 0.35)
  Top 0.152: COMM_MICRO.15 35.95,43.06 34.8,41.91 34.8,36.61 v34.2,36.01
  Bottom 0.152: JP2.25 49.25,71.46 31.2,53.41 31.2,37.71 32.9,36.01 v34.2,36.01
UART_TX  (via drill 0.35)
  Top 0.152: P1.4 75.33,57.13 74.4,56.21 v74.4,48.81 | v36.9,40.21 35.8,41.31 35.8,41.91 36.5,42.61 36.55,42.56 COMM_MICRO.16
  Bottom 0.152: v74.4,48.81 65.8,40.21 v36.9,40.21
UART_TX_BUS  (via drill 0.35)
  Top 0.152: v31.6,35.81 32.5,35.81 34.1,37.41 34.1,42.41 35.25,43.56 COMM_MICRO.14
  Bottom 0.152: JP2.23 46.71,72.32 28.1,53.71 28.1,38.71 31,35.81 v31.6,35.81
VCC  (via drill 0.35)
  Top 0.305: 6.3,61.61 6.3,75.01 12.6,81.31 28.54,81.31 JP2.12 JP2.11 31.47,72.01 R5.2 35.18,69.08 v36.8,70.71 | 6.3,61.61 17.55,50.36 | 17.55,50.36 17.6,50.31 17.6,46.41 23.9,40.11 | COMM_MICRO.13 34.05,44.06 32.9,42.91 C5.1 29.5,40.11 23.9,40.11 | COMM_MICRO.1 37.16,50.01 33.4,50.01 32.3,51.11 C4.1 32.3,53.21 31.1,54.41 | COMM_MICRO.64 39.05,54.66 C3.1 38,55.71 38,54.71 37.7,54.41 31.1,54.41 | COMM_MICRO.19 40.05,36.26 C1.1 39.9,33.81 v39.4,33.81 | COMM_MICRO.32 46.55,38.36 47.7,37.21 49.6,37.21 C2.1 49.8,38.31 v50.6,39.11 | COMM_MICRO.48 53.35,50.06 58.7,55.41 62.7,55.41 64.1,54.01 64.1,48.51 | 64.1,48.51 64.1,47.41 v64,47.31 | v76.8,49.71 77.7,50.61 77.7,53.18 P1.1 | 31.1,54.41 21.6,54.41 17.55,50.36 | v24.8,39.31 24.7,39.31 23.9,40.11 | 6.3,61.61 6.3,33.81 v6.4,33.71 6.4,22.91 19.5,9.81 50.9,9.81 61.85,20.76 | 61.85,20.76 TX_RADIO.13 66.8,21.01 C7.1 69.3,23.11 v69.3,23.81 | v60.4,39.01 61.1,38.31 61.1,29.21 59.4,27.51 59.4,23.21 61.85,20.76 | COMM_CAN_TRANSCEIVER.3 62.73,49.87 64.1,48.51 | v39.8,71.01 40.8,70.01 40.8,68.28 | 40.8,67.81 40.8,68.28 | 40.8,68.28 R3.2
  Bottom 0.305: v64,47.31 64.2,47.31 65.3,46.21 68.5,46.21 72,49.71 v76.8,49.71 77.2,49.31 77.2,46.81 69.3,38.91 v69.3,23.81 | v24.8,39.31 24.85,39.26 24.85,39.16 29.95,34.06 30.2,33.81 v39.4,33.81 | v6.4,33.71 6.4,31.41 16.8,21.01 C8.1 RX_RADIO.13 | v50.6,39.11 50.7,39.01 v60.4,39.01 | v36.8,70.71 37.1,71.01 v39.8,71.01

### Text on the board
tNames: Caurin_CDH v.1.0 | Zenith Aerospace - 2019